# Altium schematic sheet pca10201_switch_fsa.SchDoc: =BoardTitle + ' - Switch FSA'
size A3; Organization: Nordic Semiconductor; DocumentNumber: 9; SheetNumber: 9; SheetTotal: 10; CompanyName: Nordic Semiconductor; DocumentSize: A4
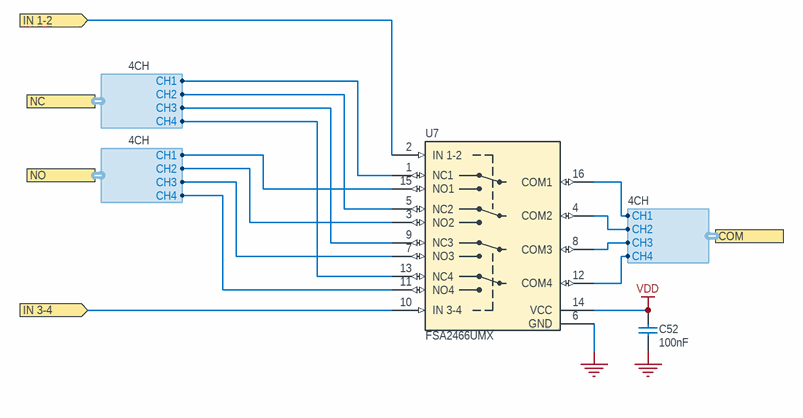
[diagram p0: pca10201_switch_fsa.SchDoc]

## Parts
C52  100nF  [CAPC0603X03L_C]
U7  FSA2466UMX  [XQFN40P180X260X50-16N]

## Ports
COM (harness 4CH), IN 1-2 (in), IN 3-4 (in), NC (harness 4CH), NO (harness 4CH)

## Harnesses
4CH: CH1, CH2, CH3, CH4

## Nets
GND: C52.2 U7.6(GND)
VDD: C52.1 U7.14(VCC)
IN 1-2: U7.2(IN_1-2) ; port IN 1-2
IN 3-4: U7.10(IN_3-4) ; port IN 3-4
NetU7_1: U7.1(NC1) ; port NC.CH1
NetU7_3: U7.3(NO2) ; port NO.CH2
NetU7_4: U7.4(COM2) ; port COM.CH2
NetU7_5: U7.5(NC2) ; port NC.CH2
NetU7_7: U7.7(NO3) ; port NO.CH3
NetU7_8: U7.8(COM3) ; port COM.CH3
NetU7_9: U7.9(NC3) ; port NC.CH3
NetU7_11: U7.11(NO4) ; port NO.CH4
NetU7_12: U7.12(COM4) ; port COM.CH4
NetU7_13: U7.13(NC4) ; port NC.CH4
NetU7_15: U7.15(NO1) ; port NO.CH1
NetU7_16: U7.16(COM1) ; port COM.CH1

## Notes on the sheet
- Title
- Size
- Date:
- File:
- A3
- PCB Assembly Number
- Sheet
- Drawn By:
- Revision
- of
- Classification:

## Library data of the parts
C52 = C0201-100n: Capacitor, X5R, ±10%, 100nF, 16V; Manufacturer: N.A.; Part number IPS: 00000001248, 00000002505; Part number Norautron: 262071862; Part number NEMS: 100200078; Pad Count: 2; Component Status: Active; Part Number: C0201-100n; Manufacturer Part Number: N.A.; ComponentLink1URL: N.A.; ComponentLink1Description: Datasheet; ComponentLink2URL: N.A.; ComponentLink2Description: Supplier link; HelpURL: N.A.; Footprint Doc: 0201; LatestRevisionDate: 2024-06-27; Published: 2014-11-13; Value: 100nF; Note: 16V; Artikkelnr Noca: N.A.; Supplier 1: N.A.; Supplier Part Number 1: N.A.; Supplier 2: N.A.; Supplier Part Number 2: N.A.; Component Class: Capacitors; PartId: 100200078; Author: rsk
U7 = FSA2466UMX: Data / Audio Low-Voltage Dual DPDT Analog Switch; Manufacturer: ON Semiconductor; Part number IPS: 00000009986; Part number Norautron: 26500608; Part number NEMS: 101900422; Note: N.A.; Artikkelnr Noca: 15070069; Pad Count: 16; Component Status: Active; Part Number: FSA2466UMX; Manufacturer Part Number: FSA2466UMX; ComponentLink1URL: N.A.; ComponentLink1Description: Datasheet; ComponentLink2URL: N.A.; ComponentLink2Description: Supplier link; HelpURL: https://www.onsemi.com/pub/Collateral/FSA2466-D.PDF; Footprint Doc: UFQFN-16; LatestRevisionDate: 2019-05-15; Published: 2016-05-18; Value: FSA2466UMX; Supplier 1: Digi-Key; Supplier Part Number 1: FSA2466UMXCT-ND; Supplier 2: Mouser; Supplier Part Number 2: 512-FSA2466UMX; Component Class: Misc_ICs; PartId: 101900422; Author: rsk